# Altium schematic sheet FSR-PRJ.SchDoc
size A4
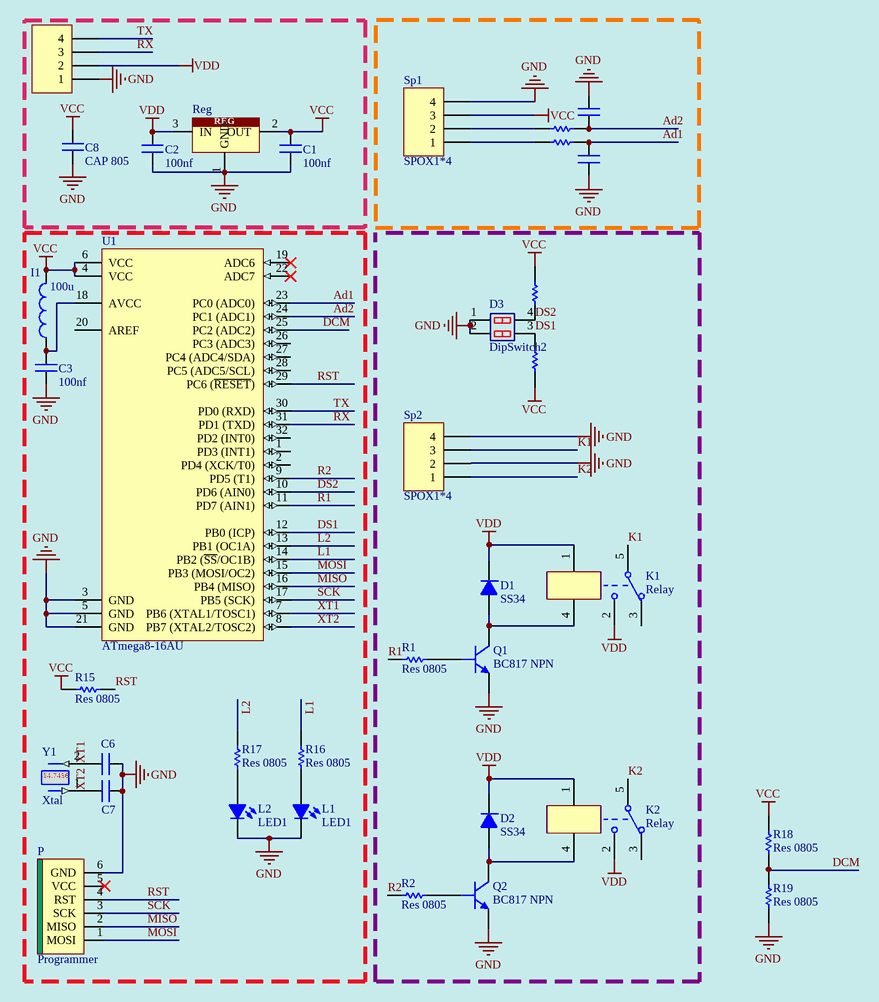
[diagram p0: FSR-PRJ.SchDoc]

## Parts
C1  100nf  [Cap0805]
C2  100nf  [Cap0805]
C3  100nf  [Cap0805]
C4  CAP 805  [Cap0805]  (value not drawn)
C5  CAP 805  [Cap0805]  (value not drawn)
C6  CAP 805  [Cap0805]  (value not drawn)
C7  CAP 805  [Cap0805]  (value not drawn)
C8  CAP 805  [Cap0805]
D1  SS34  [Diod-1A-SMD]
D2  SS34  [Diod-1A-SMD]
D3  DipSwitch2  [DipSwitch2]
I1  100u  [1206]
K1  Relay  [RelayMinionSmall]
K2  Relay  [RelayMinionSmall]
L1  LED1  [LED_SMD0805RED]
L2  LED1  [LED_SMD0805RED]
P  Programmer  [Programmer]
Q1  BC817 NPN  [SOT23]
Q2  BC817 NPN  [SOT23]
R1  Res 0805  [R0805]
R2  Res 0805  [R0805]
R9  Res 0805  [R0805]  (value not drawn)
R10  Res 0805  [R0805]  (value not drawn)
R12  Res 0805  [R0805]  (value not drawn)
R13  Res 0805  [R0805]  (value not drawn)
R15  Res 0805  [R0805]
R16  Res 0805  [R0805]
R17  Res 0805  [R0805]
R18  Res 0805  [R0805]
R19  Res 0805  [R0805]
Reg  LM1117  [DPACK]  (value not drawn)
Sp1  SPOX1*4  [SPOX_1*4RIGHT]
Sp2  SPOX1*4  [SPOX_1*4RIGHT]
Sp3  SPOX1*4  [SPOX_1*4RIGHT]  (value not drawn)
U1  ATmega8-16AU  [32A_N]
Y1  Xtal  [CrystallB]

## Nets
GND: C1.1 C2.1 C3.1 C4.1 C5.1 C6.2 C7.2 C8.1 D3.1 D3.2 L1.K L2.K P.6(GND) Q1.2(E) Q2.2(E) R19.2 Reg.1(GND) Sp1.4 Sp2.2 Sp2.4 Sp3.1 U1.3(GND) U1.5(GND) U1.21(GND)
VCC: C1.2 C8.2 I1.2 R9.1 R10.2 R15.2 R18.1 Reg.2(OUT) Sp1.3 U1.4(VCC) U1.6(VCC)
VDD: C2.2 D1.K D2.K K1.1 K1.2 K2.1 K2.2 Reg.3(IN) Sp3.2
Ad1: C5.2 R13.2 U1.23(PC0_(ADC0))
Ad2: C4.2 R12.2 U1.24(PC1_(ADC1))
DCM: R18.2 R19.1 U1.25(PC2_(ADC2))
DS1: D3.3 R10.1 U1.12(PB0_(ICP))
DS2: D3.4 R9.2 U1.10(PD6_(AIN0))
K1: K1.5 Sp2.3
K2: K2.5 Sp2.1
L1: R16.2 U1.14(PB2_(~{SS}/OC1B))
L2: R17.2 U1.13(PB1_(OC1A))
MISO: P.2(MISO) U1.16(PB4_(MISO))
MOSI: P.1(MOSI) U1.15(PB3_(MOSI/OC2))
R1: R1.2 U1.11(PD7_(AIN1))
R2: R2.2 U1.9(PD5_(T1))
RST: P.4(RST) R15.1 U1.29(PC6_(~{RESET}))
RX: Sp3.3 U1.31(PD1_(TXD))
SCK: P.3(SCK) U1.17(PB5_(SCK))
TX: Sp3.4 U1.30(PD0_(RXD))
XT1: C6.1 U1.7(PB6_(XTAL1/TOSC1)) Y1.2
XT2: C7.1 U1.8(PB7_(XTAL2/TOSC2)) Y1.1
NetC3_2: C3.2 I1.1 U1.18(AVCC)
NetD1_A: D1.A K1.4 Q1.3(C)
NetD2_A: D2.A K2.4 Q2.3(C)
NetL1_A: L1.A R16.1
NetL2_A: L2.A R17.1
NetQ1_1: Q1.1(B) R1.1
NetQ2_1: Q2.1(B) R2.1
NetR12_1: R12.1 Sp1.2
NetR13_1: R13.1 Sp1.1

Not connected (* = marked no-connect by the designer): K1 3; K2 3; P 5(VCC)*; U1 1(PD3_(INT1)) 2(PD4_(XCK/T0)) 19(ADC6)* 20(AREF) 22(ADC7)* 26(PC3_(ADC3)) 27(PC4_(ADC4/SDA)) 28(PC5_(ADC5/SCL)) 32(PD2_(INT0))

## Notes on the sheet
- Title
- Size:
- Data:
- CompanyName:
- A4
- Number:
- Time:
- Revision:
- Engineer:
- File:
- (in symbol Crystal) 14.7456
- (in symbol LM1117) REG

## Library data of the parts
C1-C8 = Cap0805: surface mount capacitor (size 805)
D1 D2 = Diode
I1 = Indicator100uH
K1 K2 = RelayMilon
Q1 Q2 = Transistor NPN
U1 = ATmega8-16AU: 8-bit AVR Microcontroller, 4.5-5.5V, 16MHz, 8KB Flash, 512 Bytes EEPROM, 1KB SRAM, 32-pin TQFP, Industrial Grade (-40°C to 85°C); DatasheetVersion: revZ, Feb-2011; PackageVersion: revC, Oct-2010; PackageReference: 32A; PackageDescription: 32-Lead, 7x7x1.0 mm Body, 0.8mm Lead Pitch, Thin Profile Plastic Quad Flat Package (TQFP); Code_JEDEC: MS-026-ABA; ComponentLink1Description: Manufacturer URL; ComponentLink1URL: http://www.atmel.com/; ComponentLink2Description: ATmega8(L); ComponentLink2URL: http://www.atmel.com/dyn/resources/prod_documents/doc2486.pdf; ComponentLink3Description: ATmega8(L) Summary; ComponentLink3URL: http://www.atmel.com/dyn/resources/prod_documents/2486S.pdf
Y1 = Crystal